# EAGLE design FAL65816_Backplane (EAGLE 7.2.0)
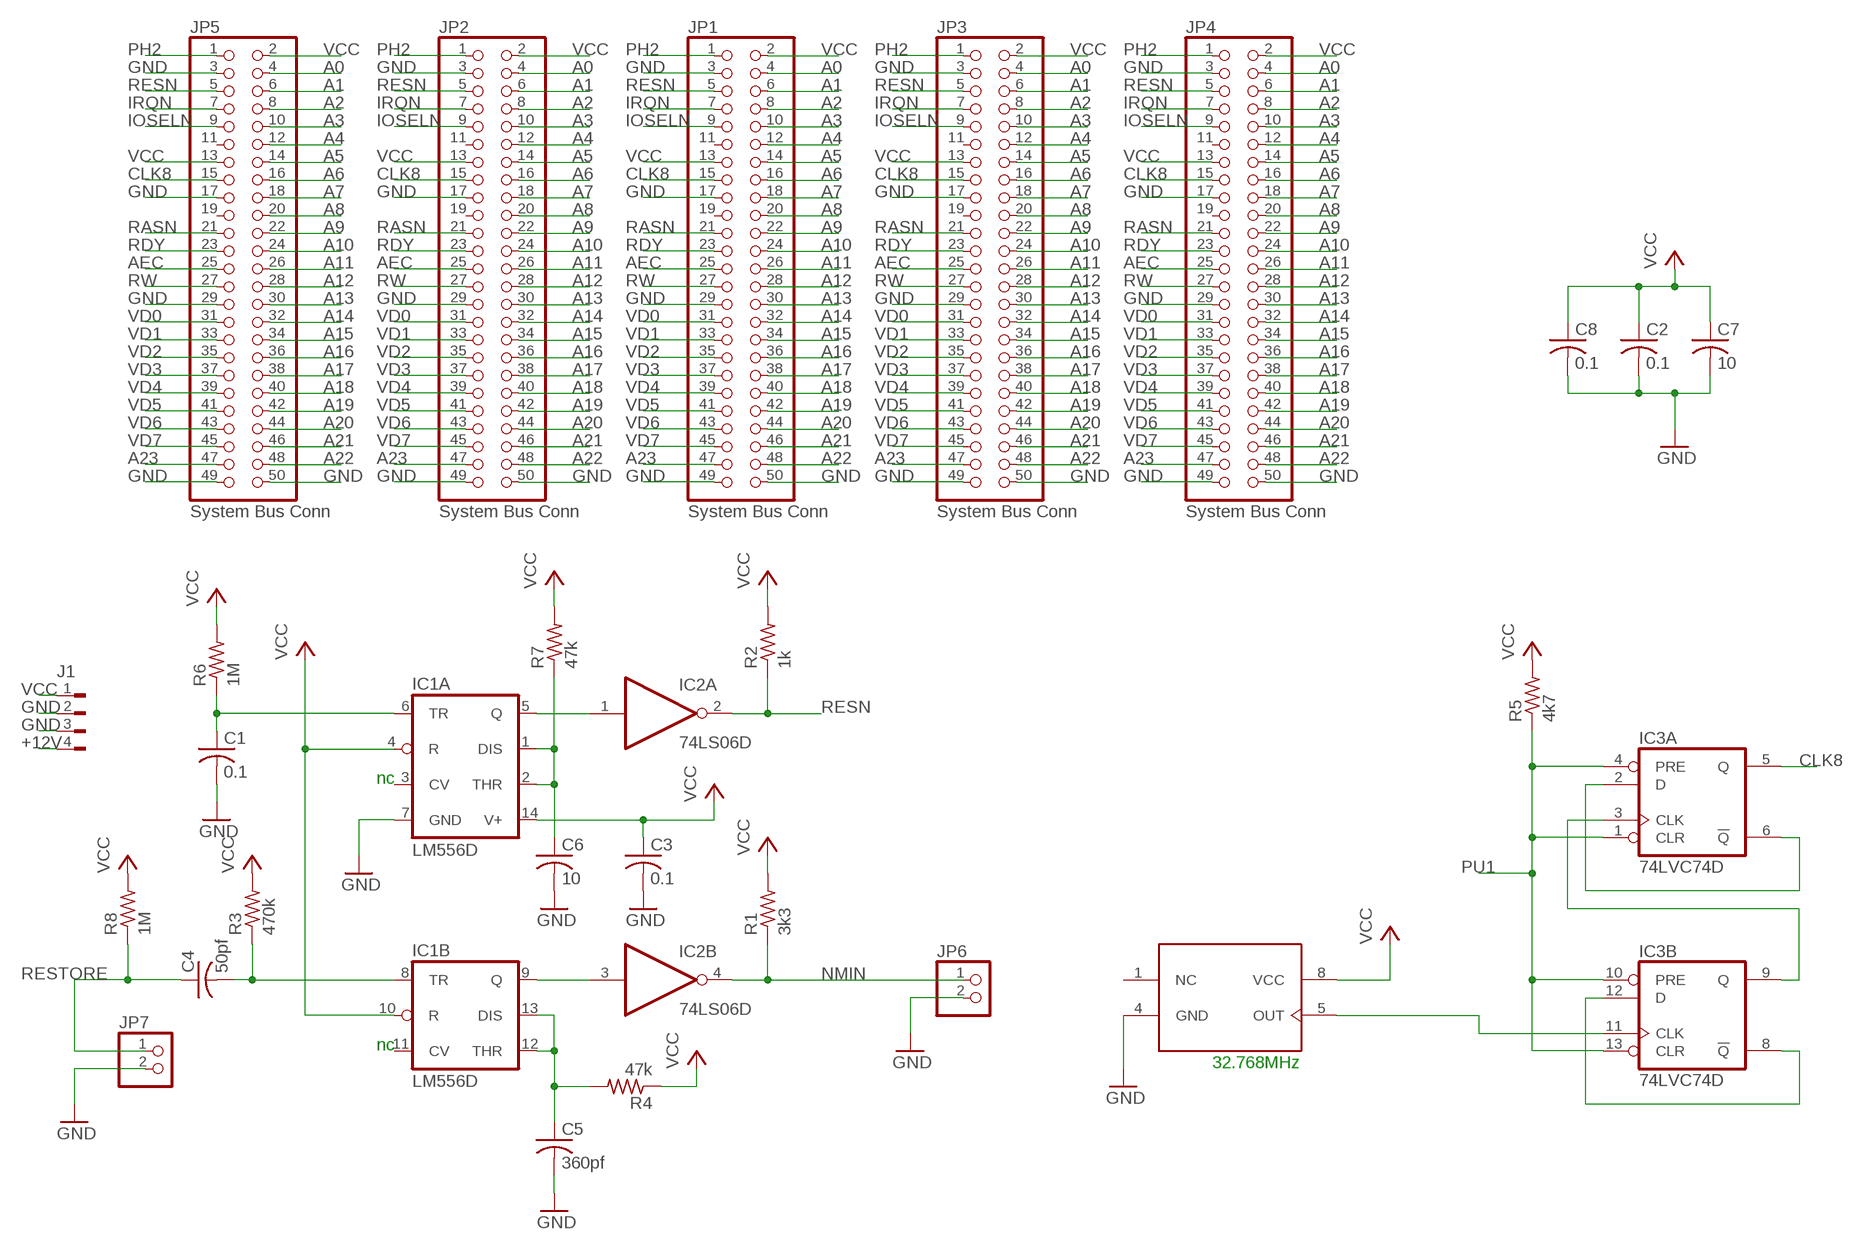
[diagram p0: schematic, sheet 1]

## Parts
C1  0.1  C-US050-024X044  [C050-024X044]
C2  0.1  C-US050-024X044  [C050-024X044]
C3  0.1  C-US050-024X044  [C050-024X044]
C4  50pf  C-US050-024X044  [C050-024X044]
C5  360pf  C-US050-024X044  [C050-024X044]
C6  10  C-US050-024X044  [C050-024X044]
C7  10  C-US050-024X044  [C050-024X044]
C8  0.1  C-US050-024X044  [C050-024X044]
IC1  LM556D  [SO14]
IC2  74LS06D  [SO14]
IC3  74LVC74D  74LS74D  [SO14]
J1  FLOPPY-4  [FLOPPY-4]
JP1  System Bus Conn  PINHD-2X25  [2X25]
JP2  System Bus Conn  PINHD-2X25  [2X25]
JP3  System Bus Conn  PINHD-2X25  [2X25]
JP4  System Bus Conn  PINHD-2X25  [2X25]
JP5  System Bus Conn  PINHD-2X25  [2X25]
JP6  PINHD-1X2  [1X02]
JP7  PINHD-1X2  [1X02]
R1  3k3  R-US_0204/7  [0204/7]
R2  1k  R-US_0204/7  [0204/7]
R3  470k  R-US_0204/7  [0204/7]
R4  47k  R-US_0204/7  [0204/7]
R5  4k7  R-US_0204/7  [0204/7]
R6  1M  R-US_0204/7  [0204/7]
R7  47k  R-US_0204/7  [0204/7]
R8  1M  R-US_0204/7  [0204/7]
U$1  OSC  [DIL08]

## Nets
+12V: J1.4
A0: JP1.4 JP2.4 JP3.4 JP4.4 JP5.4
A1: JP1.6 JP2.6 JP3.6 JP4.6 JP5.6
A2: JP1.8 JP2.8 JP3.8 JP4.8 JP5.8
A3: JP1.10 JP2.10 JP3.10 JP4.10 JP5.10
A4: JP1.12 JP2.12 JP3.12 JP4.12 JP5.12
A5: JP1.14 JP2.14 JP3.14 JP4.14 JP5.14
A6: JP1.16 JP2.16 JP3.16 JP4.16 JP5.16
A7: JP1.18 JP2.18 JP3.18 JP4.18 JP5.18
A8: JP1.20 JP2.20 JP3.20 JP4.20 JP5.20
A9: JP1.22 JP2.22 JP3.22 JP4.22 JP5.22
A10: JP1.24 JP2.24 JP3.24 JP4.24 JP5.24
A11: JP1.26 JP2.26 JP3.26 JP4.26 JP5.26
A12: JP1.28 JP2.28 JP3.28 JP4.28 JP5.28
A13: JP1.30 JP2.30 JP3.30 JP4.30 JP5.30
A14: JP1.32 JP2.32 JP3.32 JP4.32 JP5.32
A15: JP1.34 JP2.34 JP3.34 JP4.34 JP5.34
A16: JP1.36 JP2.36 JP3.36 JP4.36 JP5.36
A17: JP1.38 JP2.38 JP3.38 JP4.38 JP5.38
A18: JP1.40 JP2.40 JP3.40 JP4.40 JP5.40
A19: JP1.42 JP2.42 JP3.42 JP4.42 JP5.42
A20: JP1.44 JP2.44 JP3.44 JP4.44 JP5.44
A21: JP1.46 JP2.46 JP3.46 JP4.46 JP5.46
A22: JP1.48 JP2.48 JP3.48 JP4.48 JP5.48
A23: JP1.47 JP2.47 JP3.47 JP4.47 JP5.47
AEC: JP1.25 JP2.25 JP3.25 JP4.25 JP5.25
CLK8: IC3.5(A:Q) JP1.15 JP2.15 JP3.15 JP4.15 JP5.15
GND: C1.2 C2.2 C3.2 C5.2 C6.2 C7.2 C8.2 IC1.7(A:GND) J1.2 J1.3 JP1.3 JP1.17 JP1.29 JP1.49 JP1.50 JP2.3 JP2.17 JP2.29 JP2.49 JP2.50 JP3.3 JP3.17 JP3.29 JP3.49 JP3.50 JP4.3 JP4.17 JP4.29 JP4.49 JP4.50 JP5.3 JP5.17 JP5.29 JP5.49 JP5.50 JP6.2 JP7.2 U$1.4(GND)
IOSELN: JP1.9 JP2.9 JP3.9 JP4.9 JP5.9
IRQN: JP1.7 JP2.7 JP3.7 JP4.7 JP5.7
N$2: IC3.3(A:CLK) IC3.9(B:Q)
N$3: IC1.5(A:Q) IC2.1(A:I)
N$4: IC3.8(B:!Q) IC3.12(B:D)
N$5: IC1.9(B:Q) IC2.3(B:I)
N$6: C1.1 IC1.6(A:TR) R6.1
N$7: IC3.11(B:CLK) U$1.5(OUT)
N$8: IC3.2(A:D) IC3.6(A:!Q)
N$10: C6.1 IC1.1(A:DIS) IC1.2(A:THR) R7.1
N$12: C4.2 IC1.8(B:TR) R3.1
N$14: C5.1 IC1.12(B:THR) IC1.13(B:DIS) R4.2
NMIN: IC2.4(B:O) JP6.1 R1.1
PH2: JP1.1 JP2.1 JP3.1 JP4.1 JP5.1
PU1: IC3.1(A:CLR) IC3.4(A:PRE) IC3.10(B:PRE) IC3.13(B:CLR) R5.1
RASN: JP1.21 JP2.21 JP3.21 JP4.21 JP5.21
RDY: JP1.23 JP2.23 JP3.23 JP4.23 JP5.23
RESN: IC2.2(A:O) JP1.5 JP2.5 JP3.5 JP4.5 JP5.5 R2.1
RESTORE: C4.1 JP7.1 R8.1
RW: JP1.27 JP2.27 JP3.27 JP4.27 JP5.27
VCC: C2.1 C3.1 C7.1 C8.1 IC1.4(A:R) IC1.10(B:R) IC1.14(A:V+) J1.1 JP1.2 JP1.13 JP2.2 JP2.13 JP3.2 JP3.13 JP4.2 JP4.13 JP5.2 JP5.13 R1.2 R2.2 R3.2 R4.1 R5.2 R6.2 R7.2 R8.2 U$1.8(VCC)
VD0: JP1.31 JP2.31 JP3.31 JP4.31 JP5.31
VD1: JP1.33 JP2.33 JP3.33 JP4.33 JP5.33
VD2: JP1.35 JP2.35 JP3.35 JP4.35 JP5.35
VD3: JP1.37 JP2.37 JP3.37 JP4.37 JP5.37
VD4: JP1.39 JP2.39 JP3.39 JP4.39 JP5.39
VD5: JP1.41 JP2.41 JP3.41 JP4.41 JP5.41
VD6: JP1.43 JP2.43 JP3.43 JP4.43 JP5.43
VD7: JP1.45 JP2.45 JP3.45 JP4.45 JP5.45
Unconnected: IC1.3(A:CV) IC1.11(B:CV) IC2.5(C:I) IC2.6(C:O) IC2.8(D:O) IC2.9(D:I) IC2.10(E:O) IC2.11(E:I) IC2.12(F:O) IC2.13(F:I) JP1.11 JP1.19 JP2.11 JP2.19 JP3.11 JP3.19 JP4.11 JP4.19 JP5.11 JP5.19 U$1.1(NC)

## Notes on the sheet
- nc
- nc
- 32.768MHz

## Power pins joined to a net without a drawn wire
GND: IC2.7(P:GND) IC3.7(P:GND)
VCC: IC2.14(P:VCC) IC3.14(P:VCC)

## Library data of the parts
C1-C8 = rcl:C-US: CAPACITOR, American symbol
IC1 = linear:*556: Dual TIMER
IC2 = FT74xx:74*06: Hex INVERTER, open collector high-voltage output
IC3 = FT74xx:74*74: Dual D type positive edge triggered FLIP FLOP, preset and clear
J1 = con-amp:FLOPPY-4: MATE N-LOCK Floppy / HDD conector Distributor: Bürklin 71F970
JP1-JP5 = pinhead:PINHD-2X25: PIN HEADER
JP6 JP7 = pinhead:PINHD-1X2: PIN HEADER
R1-R8 = resistor:R-US_: RESISTOR, American symbol
U$1 = FT74xx:OSC

## Board
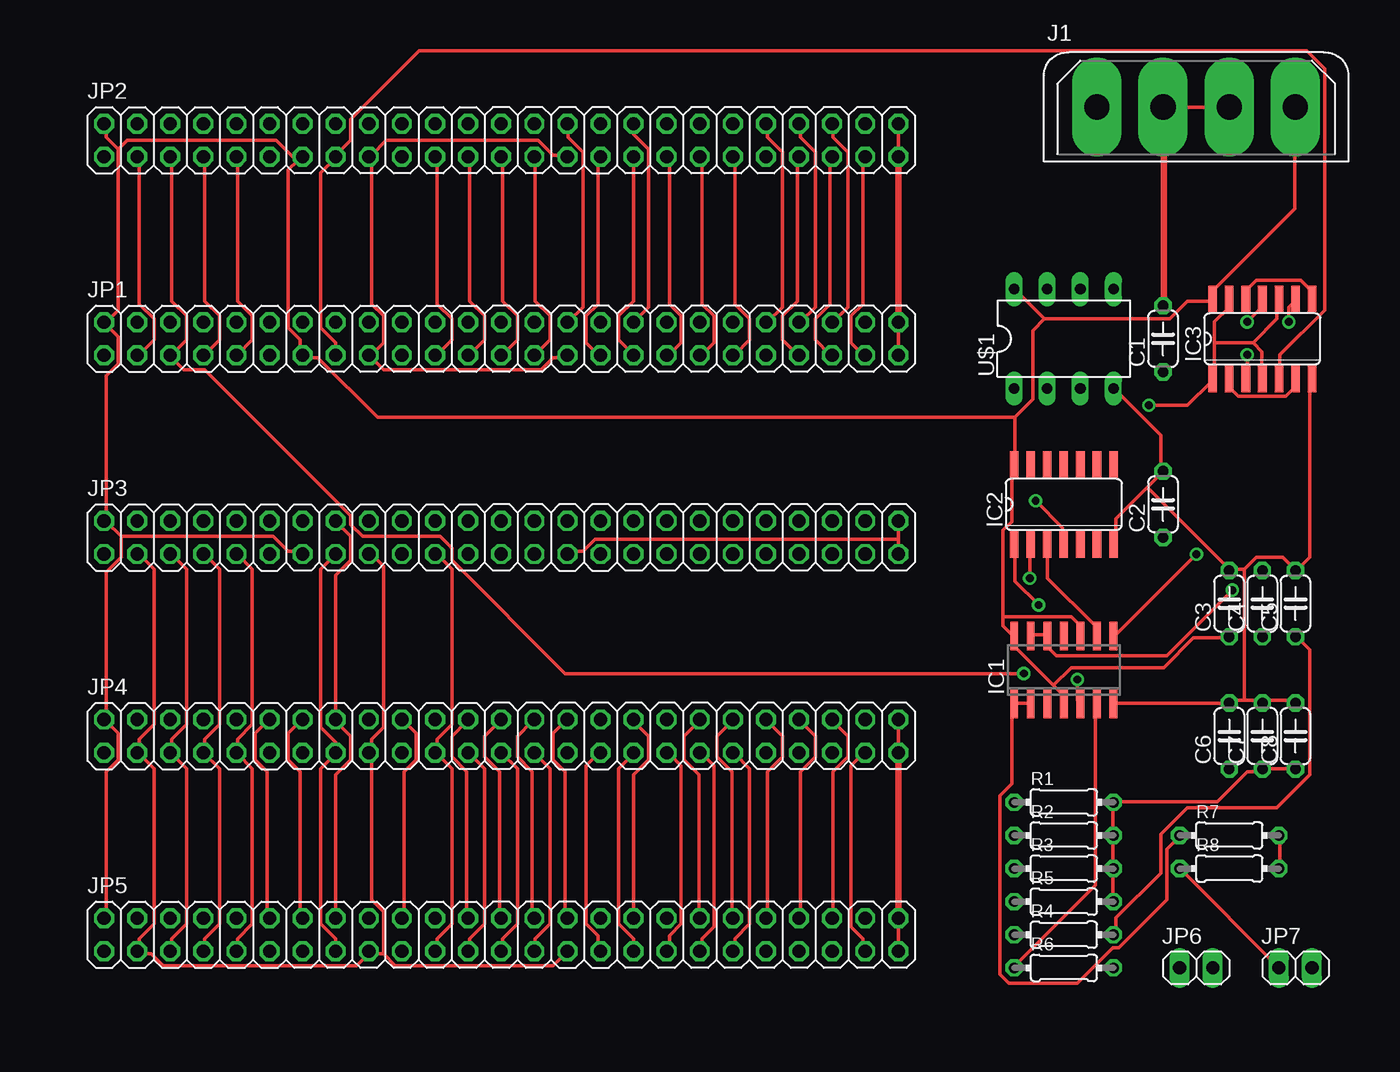
[diagram p1: board, top side]
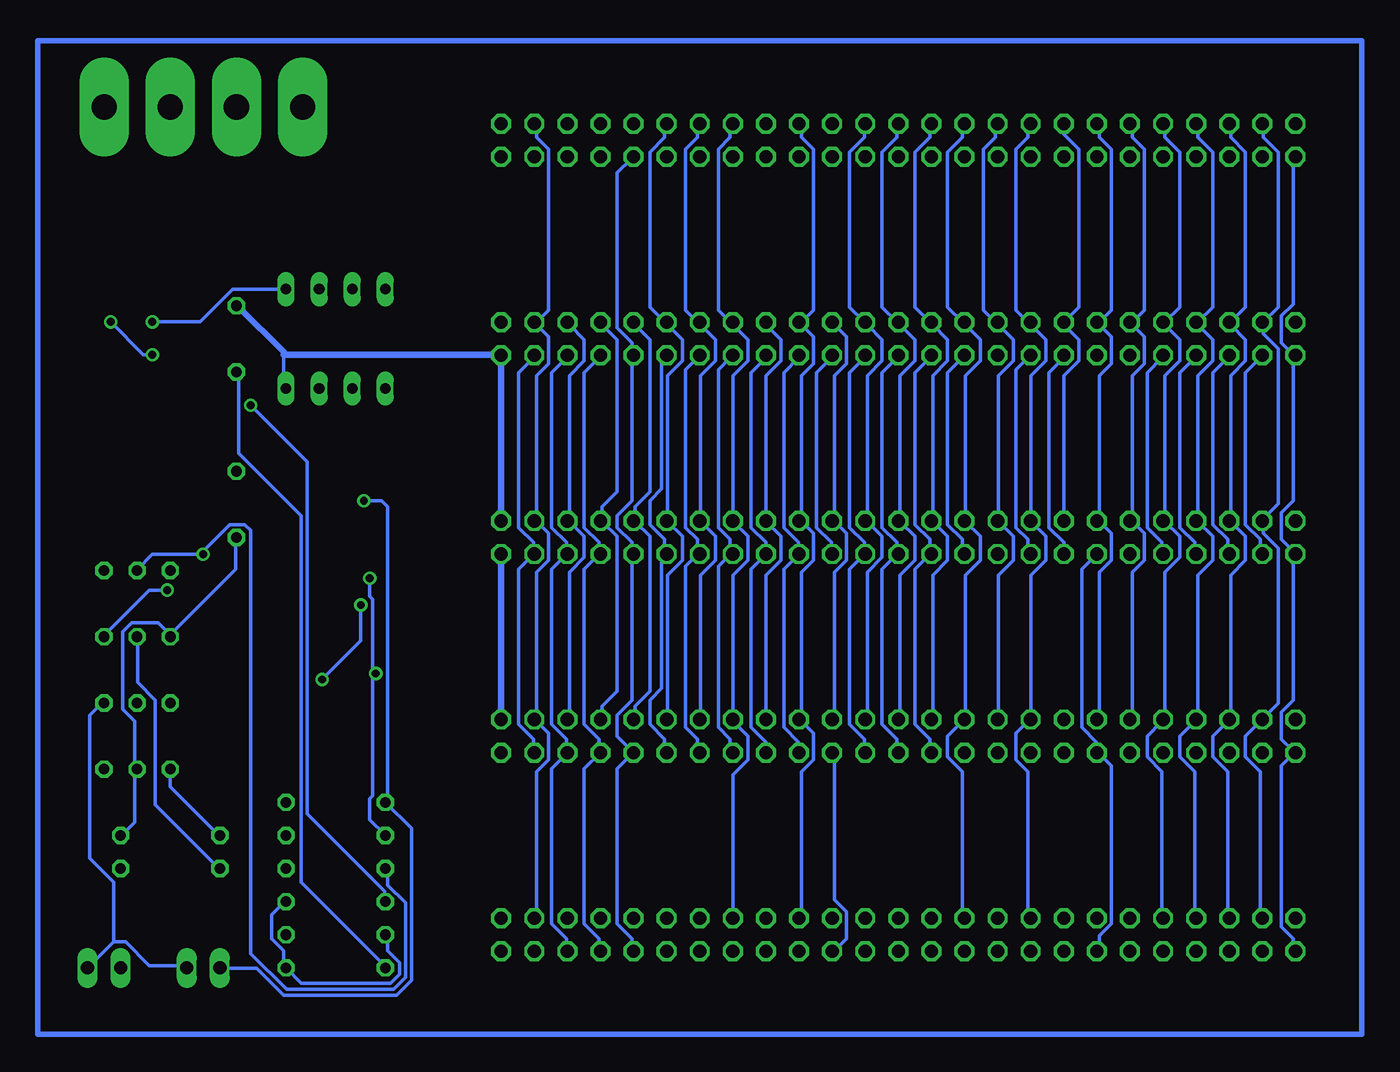
[diagram p2: board, bottom side, seen from below]

No outline drawn. Coordinates in mm, seen from the top.
Copper layers (1*16): Top 0.035mm / dielectric 1.5mm / Bottom 0.035mm
Design rules "default": minimum track width 10mil, minimum drill 24mil, track to track 8mil, track to pad 8mil, pad to pad 8mil, via to via 8mil, smd to smd 8mil, copper to edge 40mil, drill to drill 8mil, minimum pad ring 10mil, minimum via ring 8mil, stop-mask expansion 4mil, vias tented up to drill 0mil, thermal gap 10mil

### Footprints (pad centres in the part's own frame; a part is rotated, then mirrored left to right if it is on the bottom)
C050-024X044 = drill 0.813 octagon: 1 -2.54,0; 2 2.54,0
SO14 = smd 0.6 x 2.2: 1 -3.81,-2.6; 2 -2.54,-2.6; 3 -1.27,-2.6; 4 0,-2.6; 5 1.27,-2.6; 6 2.54,-2.6; 7 3.81,-2.6; 8 3.81,2.6; 9 2.54,2.6; 10 1.27,2.6; 11 0,2.6; 12 -1.27,2.6; 13 -2.54,2.6; 14 -3.81,2.6
SO14' = smd 0.66 x 2.032: 1 -3.81,-3.073; 2 -2.54,-3.073; 3 -1.27,-3.073; 4 0,-3.073; 5 1.27,-3.073; 6 2.54,-3.073; 7 3.81,-3.073; 8 3.81,3.073; 9 2.54,3.073; 10 1.27,3.073; 11 0,3.073; 12 -1.27,3.073; 13 -2.54,3.073; 14 -3.81,3.073
FLOPPY-4 = drill 1.93 pad 3.81 long: 1 7.62,0; 2 2.54,0; 3 -2.54,0; 4 -7.62,0
2X25 = drill 1.016 octagon: 1 -30.48,-1.27; 2 -30.48,1.27; 3 -27.94,-1.27; 4 -27.94,1.27; 5 -25.4,-1.27; 6 -25.4,1.27; 7 -22.86,-1.27; 8 -22.86,1.27; 9 -20.32,-1.27; 10 -20.32,1.27; 11 -17.78,-1.27; 12 -17.78,1.27; 13 -15.24,-1.27; 14 -15.24,1.27; 15 -12.7,-1.27; 16 -12.7,1.27; 17 -10.16,-1.27; 18 -10.16,1.27; 19 -7.62,-1.27; 20 -7.62,1.27; 21 -5.08,-1.27; 22 -5.08,1.27; 23 -2.54,-1.27; 24 -2.54,1.27; 25 0,-1.27; 26 0,1.27; 27 2.54,-1.27; 28 2.54,1.27; 29 5.08,-1.27; 30 5.08,1.27; 31 7.62,-1.27; 32 7.62,1.27; 33 10.16,-1.27; 34 10.16,1.27; 35 12.7,-1.27; 36 12.7,1.27; 37 15.24,-1.27; 38 15.24,1.27; 39 17.78,-1.27; 40 17.78,1.27; 41 20.32,-1.27; 42 20.32,1.27; 43 22.86,-1.27; 44 22.86,1.27; 45 25.4,-1.27; 46 25.4,1.27; 47 27.94,-1.27; 48 27.94,1.27; 49 30.48,-1.27; 50 30.48,1.27
1X02 = drill 1.016 long: 1 -1.27,0; 2 1.27,0
0204/7 = drill 0.813 octagon: 1 -3.81,0; 2 3.81,0
DIL08 = drill 0.813 long: 1 -3.81,-3.81; 2 -1.27,-3.81; 3 1.27,-3.81; 4 3.81,-3.81; 5 3.81,3.81; 6 1.27,3.81; 7 -1.27,3.81; 8 -3.81,3.81

### Placement (x,y rotation side)
C1  86.36,53.34 90 top
C2  86.36,40.64 90 top
C3  91.44,33.02 90 top
C4  93.98,33.02 90 top
C5  96.52,33.02 90 top
C6  91.44,22.86 90 top
C7  93.98,22.86 90 top
C8  96.52,22.86 90 top
IC1  78.74,27.94 0 top
IC2  74LS06D  [SO14']  78.74,40.64 0 top
IC3  74LVC74D  [SO14']  93.98,53.34 0 top
J1  88.9,71.12 0 top
JP1  35.56,53.34 0 top
JP2  35.56,68.58 0 top
JP3  35.56,38.1 0 top
JP4  35.56,22.86 0 top
JP5  35.56,7.62 0 top
JP6  88.9,5.08 0 top
JP7  96.52,5.08 0 top
R1  78.74,17.78 0 top
R2  78.74,15.24 0 top
R3  78.74,12.7 0 top
R4  78.74,7.62 0 top
R5  78.74,10.16 0 top
R6  78.74,5.08 0 top
R7  91.44,15.24 0 top
R8  91.44,12.7 0 top
U$1  78.74,53.34 0 top

### Tracks (layer width: path | path; a pad name or v marks a point on that pad's centre or on a via)
A0
  Bottom 0.254: JP5.4 7.77,8.91 7.77,20.12 8.91,21.26 8.91,22.86 7.77,24 JP4.4 7.54,24.23 6.4,25.38 6.4,37.26 7.54,38.41 7.54,39.32 JP3.4 7.54,39.55 6.4,40.69 6.4,52.58 7.54,53.72 7.54,54.41 JP1.4 7.54,54.63 6.4,55.78 6.4,67.67 7.54,68.81 7.54,69.72 JP2.4
A1
  Bottom 0.254: JP5.6 10.29,8.91 10.29,20.12 11.43,21.26 11.43,22.86 JP4.6 10.06,24.23 10.06,35.2 8.91,36.35 8.91,38.18 10.06,39.32 JP3.6 10.06,39.55 10.06,50.52 8.91,51.66 8.91,53.26 10.06,54.41 JP1.6 10.06,54.63 8.91,55.78 8.91,67.67 10.06,68.81 10.06,69.72 JP2.6
A2
  Bottom 0.254: JP5.8 12.8,8.91 12.8,20.12 13.95,21.26 13.95,22.86 12.8,24 JP4.8 12.57,24.23 12.57,35.2 11.43,36.35 11.43,38.18 12.57,39.32 JP3.8 12.57,39.55 12.57,50.52 11.43,51.66 11.43,53.26 12.57,54.41 JP1.8 12.57,54.63 11.43,55.78 11.43,67.67 12.57,68.81 12.57,69.72 JP2.8
A3
  Bottom 0.254: JP5.10 15.32,8.91 15.32,20.12 16.46,21.26 16.46,22.86 15.32,24 JP4.10 15.09,24.23 15.09,35.43 13.95,36.58 13.95,38.18 15.09,39.32 JP3.10 15.09,39.55 15.09,50.52 13.95,51.66 13.95,53.26 15.09,54.41 JP1.10 15.09,54.63 13.95,55.78 13.95,67.67 15.09,68.81 15.09,69.72 JP2.10
A4
  Top 0.254: JP5.12 17.6,8.91 17.6,20.12 16.69,21.03 16.69,23.09 17.6,24 JP4.12
  Bottom 0.254: JP2.12 17.6,69.72 17.6,68.81 16.69,67.89 16.69,55.55 17.6,54.63 JP1.12 17.6,54.41 16.69,53.49 16.69,51.44 17.6,50.52 17.6,39.55 JP3.12 17.6,39.32 16.69,38.41 16.69,36.35 17.6,35.43 17.6,24.23 JP4.12
A5
  Top 0.254: JP5.14 20.12,8.91 20.12,20.12 19.2,21.03 19.2,23.09 20.12,24 JP4.14
  Bottom 0.254: JP2.14 20.12,69.72 20.12,68.81 19.2,67.89 19.2,55.55 20.12,54.63 JP1.14 19.2,53.49 19.2,51.44 20.12,50.52 20.12,39.55 JP3.14 20.12,39.32 19.2,38.41 19.2,36.35 20.12,35.43 20.12,24.23 JP4.14
A6
  Top 0.254: JP5.16 22.86,19.89 24,21.03 24,22.86 22.86,24 JP4.16 22.86,35.2 24,36.35 24,38.18 22.86,39.32 JP3.16
  Bottom 0.254: JP3.16 22.86,50.52 21.72,51.66 21.72,53.26 22.86,54.41 JP1.16 22.86,54.63 21.72,55.78 21.72,67.89 22.86,69.04 JP2.16
A7
  Bottom 0.254: JP5.18 25.6,8.91 25.6,20.12 26.52,21.03 26.52,23.09 25.6,24 JP4.18 25.38,24.23 25.38,35.2 24.23,36.35 24.23,38.18 25.38,39.32 JP3.18 25.38,39.55 25.38,50.52 24.23,51.66 24.23,53.26 25.38,54.41 JP1.18 25.6,54.63 26.52,55.55 26.52,67.89 25.6,68.81 25.6,69.72 JP2.18
A8
  Top 0.254: JP5.20 28.12,8.91 28.12,20.12 29.03,21.03 29.03,23.09 28.12,24 JP4.20
  Bottom 0.254: JP2.20 28.12,69.72 28.12,68.81 29.03,67.89 29.03,55.55 28.12,54.63 JP1.20 27.89,54.41 26.75,53.26 26.75,51.66 27.89,50.52 27.89,39.55 JP3.20 26.75,38.18 26.75,36.35 27.89,35.2 27.89,24.23 JP4.20
A9
  Bottom 0.254: JP5.22 30.63,8.91 30.63,20.12 31.77,21.26 31.77,22.86 30.63,24 JP4.22 30.4,24.23 30.4,35.2 29.26,36.35 29.26,38.18 30.4,39.32 JP3.22 30.4,39.55 30.4,50.52 29.26,51.66 29.26,53.26 30.4,54.41 JP1.22 30.63,54.63 31.77,55.78 31.77,67.67 30.63,68.81 30.63,69.72 JP2.22
A10
  Top 0.254: JP5.24 32.92,8.91 32.92,20.12 31.77,21.26 31.77,22.86 32.92,24 JP4.24
  Bottom 0.254: JP2.24 33.15,69.72 33.15,68.81 34.29,67.67 34.29,55.78 33.15,54.63 JP1.24 32.92,54.41 31.77,53.26 31.77,51.66 32.92,50.52 32.92,39.55 JP3.24 32.92,39.32 31.77,38.18 31.77,36.35 32.92,35.2 32.92,24.23 JP4.24
A11
  Top 0.254: JP4.26 34.29,22.86 34.29,21.26 35.43,20.12 35.43,8.91 JP5.26
  Bottom 0.254: JP2.26 35.66,69.72 35.66,68.81 36.8,67.67 36.8,55.78 35.66,54.63 JP1.26 35.43,54.41 34.29,53.26 34.29,51.66 35.43,50.52 35.43,39.55 JP3.26 35.43,39.32 34.29,38.18 34.29,36.35 35.43,35.2 35.43,24.23 JP4.26
A12
  Top 0.254: JP5.28 37.95,8.91 37.95,20.12 36.8,21.26 36.8,22.86 37.95,24 JP4.28
  Bottom 0.254: JP2.28 38.18,69.72 38.18,68.81 39.32,67.67 39.32,55.78 38.18,54.63 JP1.28 37.95,54.41 36.8,53.26 36.8,51.66 37.95,50.52 37.95,39.55 JP3.28 37.95,39.32 36.8,38.18 36.8,36.58 37.95,35.43 37.95,24.23 JP4.28
A13
  Top 0.254: JP5.30 40.46,8.91 40.46,20.12 39.55,21.03 39.55,23.09 40.46,24 JP4.30 | JP2.30 40.69,69.72 40.69,68.81 41.83,67.67 41.83,55.78 40.69,54.63 JP1.30
  Bottom 0.254: JP1.30 40.46,54.41 39.55,53.49 39.55,51.44 40.46,50.52 40.46,39.55 JP3.30 40.46,39.32 39.55,38.41 39.55,36.35 40.46,35.43 40.46,24.23 JP4.30
A14
  Bottom 0.254: JP5.32 42.98,8.91 42.98,20.12 42.06,21.03 42.06,23.09 42.98,24 JP4.32 42.98,24.23 42.98,35.43 42.06,36.35 42.06,38.41 42.98,39.32 JP3.32 42.98,39.55 42.98,50.52 42.06,51.44 42.06,53.49 JP1.32 42.98,54.63 42.06,55.55 42.06,67.89 42.98,68.81 42.98,69.72 JP2.32
A15
  Top 0.254: JP5.34 45.72,19.89 46.86,21.03 46.86,22.86 45.72,24 JP4.34 | JP2.34 45.72,69.04 46.86,67.89 46.86,55.78 45.72,54.63 JP1.34
  Bottom 0.254: JP1.34 45.72,54.41 44.58,53.26 44.58,51.66 45.72,50.52 JP3.34 45.72,39.32 44.58,38.18 44.58,36.35 45.72,35.2 JP4.34
A16
  Bottom 0.254: JP5.36 48.23,8.91 48.23,19.89 47.09,21.03 47.09,22.86 48.23,24 JP4.36 48.23,24.23 48.23,35.2 47.09,36.35 47.09,38.18 48.23,39.32 JP3.36 48.23,39.55 48.23,50.52 47.09,51.66 47.09,53.26 48.23,54.41 JP1.36 48.46,54.63 49.38,55.55 49.38,67.89 48.46,68.81 48.46,69.72 JP2.36
A17
  Top 0.254: JP5.38 50.75,8.91 50.75,19.89 49.61,21.03 49.61,22.86 50.75,24 JP4.38
  Bottom 0.254: JP2.38 50.98,69.72 50.98,68.81 51.89,67.89 51.89,55.55 50.98,54.63 JP1.38 50.75,54.41 49.61,53.26 49.61,51.66 50.75,50.52 50.75,39.55 JP3.38 49.61,38.18 49.61,36.35 50.75,35.2 50.75,24.23 JP4.38
A18
  Top 0.254: JP5.40 53.26,8.91 53.26,20.12 52.12,21.26 52.12,22.86 53.26,24 JP4.40
  Bottom 0.254: JP2.40 53.49,69.72 53.49,68.81 54.63,67.67 54.63,55.78 53.49,54.63 JP1.40 53.26,54.41 52.12,53.26 52.12,51.66 53.26,50.52 53.26,39.55 JP3.40 53.26,39.32 52.12,38.18 52.12,36.35 53.26,35.2 53.26,24.23 JP4.40
A19
  Top 0.254: JP4.42 57.15,22.86 57.15,21.26 56.01,20.12 56.01,8.91 JP5.42 | JP2.42 56.01,69.72 56.01,68.81 57.15,67.67 57.15,55.78 56.01,54.63 JP1.42
  Bottom 0.254: JP1.42 55.78,54.41 54.63,53.26 54.63,41.6 55.78,40.46 55.78,39.55 JP3.42 55.78,39.32 54.63,38.18 54.63,26.29 55.78,25.15 55.78,24.23 JP4.42
A20
  Top 0.254: JP5.44 58.52,8.91 58.52,20.12 59.66,21.26 59.66,22.86 58.52,24 JP4.44 | JP2.44 58.52,69.72 58.52,68.81 59.66,67.67 59.66,55.78 58.52,54.63 JP1.44
  Bottom 0.254: JP1.44 58.29,54.41 57.15,53.26 57.15,41.6 58.29,40.46 58.29,39.55 JP3.44 58.29,39.32 57.15,38.18 57.15,26.29 58.29,25.15 58.29,24.23 JP4.44
A21
  Top 0.254: JP5.46 61.04,8.91 61.04,20.12 62.18,21.26 62.18,22.86 61.04,24 JP4.46 | JP2.46 61.04,69.72 61.04,68.81 62.18,67.67 62.18,55.78 61.04,54.63 JP1.46
  Bottom 0.254: JP1.46 60.81,54.41 59.66,53.26 59.66,51.66 60.81,50.52 60.81,39.55 JP3.46 60.81,39.32 59.66,38.18 59.66,36.58 60.81,35.43 60.81,24.23 JP4.46
A22
  Bottom 0.254: JP5.48 63.32,8.91 63.32,20.12 62.41,21.03 62.41,23.09 63.32,24 JP4.48 63.32,24.23 63.32,35.43 62.41,36.35 62.41,38.41 63.32,39.32 JP3.48 63.32,39.55 63.32,50.52 62.41,51.44 62.41,53.49 63.32,54.41 JP1.48 63.32,54.63 62.41,55.55 62.41,67.89 63.32,68.81 63.32,69.72 JP2.48
A23
  Top 0.254: JP5.47 63.32,6.4 63.32,7.32 62.41,8.23 62.41,20.57 63.32,21.49 JP4.47 | JP2.47 63.32,67.21 63.32,56.01 62.41,55.09 62.41,53.03 63.32,52.12 JP1.47
  Bottom 0.254: JP1.47 63.55,51.89 64.69,50.75 64.69,38.86 63.55,37.72 63.55,37.03 JP3.47 63.55,36.8 64.69,35.66 64.69,23.77 63.55,22.63 63.55,21.72 JP4.47
AEC
  Top 0.254: JP4.25 36.8,20.34 36.8,8.46 35.66,7.32 35.66,6.4 JP5.25 | JP2.25 35.66,67.21 35.66,56.24 36.8,55.09 36.8,53.26 35.66,52.12 JP1.25
  Bottom 0.254: JP1.25 35.66,51.89 36.8,50.75 36.8,38.86 35.66,37.72 35.66,37.03 JP3.25 35.66,36.8 36.8,35.66 36.8,23.77 35.66,22.63 35.66,21.72 JP4.25
CLK8
  Top 0.254: JP5.15 22.86,7.32 21.72,8.46 21.72,20.34 22.86,21.49 JP4.15 22.86,22.4 21.72,23.55 21.72,35.66 22.86,36.8 JP3.15 | IC3.5 95.33,50.29 95.33,52.12 98.75,55.55 98.75,74.07 97.38,75.44 29.26,75.44 24,70.18 24,68.58 22.86,67.44 JP2.15 22.86,67.21 21.72,66.06 21.72,54.18 22.86,53.03 JP1.15
  Bottom 0.254: JP3.15 22.86,37.72 24,38.86 24,50.75 22.86,51.89 JP1.15
GND
  Top 0.254: JP2.3 7.77,67.21 7.77,56.01 8.91,54.86 8.91,53.26 7.77,52.12 JP1.3 | JP3.3 7.77,36.8 8.91,35.66 8.91,23.77 7.77,22.63 7.77,21.72 JP4.3 7.77,21.49 8.91,20.34 8.91,8.46 7.77,7.32 7.77,6.4 JP5.3 7.77,6.17 8.69,6.17 9.6,5.26 24.46,5.26 25.38,6.17 JP5.17 25.6,6.17 26.52,6.17 | 26.52,6.17 27.43,5.26 39.55,5.26 JP5.29 | 26.52,6.17 26.52,9.37 25.6,10.29 25.6,21.49 JP4.17 25.6,21.72 25.6,22.63 26.52,23.55 26.52,35.89 25.6,36.8 JP3.17 | JP2.29 40.46,67.44 39.55,67.44 38.41,68.58 26.75,68.58 25.6,67.44 JP2.17 25.6,67.21 25.6,56.01 26.52,55.09 26.52,53.03 25.6,52.12 JP1.17 25.6,51.89 26.52,50.98 38.63,50.98 39.55,51.89 40.46,51.89 JP1.29 | JP5.49 66.06,6.4 66.06,8.69 JP5.50 66.06,8.91 | JP4.50 66.06,24 66.06,21.72 JP4.49 66.06,21.49 | JP2.50 66.06,69.72 66.06,67.44 JP2.49 66.06,67.21 | 66.06,37.95 66.06,39.32 JP3.50 | 66.06,37.95 66.06,37.03 JP3.49 | JP1.49 66.06,52.12 66.06,54.41 JP1.50 66.06,54.63 | C8.2 96.47,25.6 94.18,25.6 C7.2 93.95,25.6 92.58,25.6 | IC1.7 82.75,25.38 91.44,25.38 C6.2 91.44,25.6 92.58,25.6 | IC3.7 97.61,50.06 97.61,36.58 96.7,35.66 C5.2 96.47,35.66 95.56,36.58 93.5,36.58 92.58,35.66 | 92.58,35.66 91.44,35.66 | J1.2 91.44,71.09 86.41,71.09 J1.3 | 85.04,41.83 86.18,42.98 C2.2 86.18,43.2 86.18,45.95 82.75,49.38 U$1.4 | 85.04,41.83 82.75,39.55 82.75,37.72 IC2.7 | 86.41,56.01 C1.2 | 91.44,35.66 85.27,41.83 85.04,41.83 | 91.44,35.66 C3.2 | 92.58,35.66 92.58,25.6 | 66.06,37.95 42.75,37.95 41.83,37.03 40.69,37.03 JP3.29
  Top 0.508: 66.06,21.49 66.06,8.91 | 66.06,54.63 66.06,67.21 | 86.41,56.01 86.41,71.09
  Bottom 0.254: JP3.3 7.77,37.03 7.77,37.95 8.91,39.09 8.91,50.75 7.77,51.89 JP1.3 | JP4.29 40.46,21.49 40.46,10.29 39.55,9.37 39.55,7.32 40.46,6.4 JP5.29 | JP3.29 40.69,37.03 40.69,37.72 41.83,38.86 41.83,50.75 40.69,51.89 JP1.29 | JP3.17 25.6,37.03 25.6,37.95 26.52,38.86 26.52,50.98 25.6,51.89 JP1.17 | 66.06,39.55 JP3.50 | 66.06,51.89 JP1.49 66.06,52.12 | 66.06,24.23 JP4.50 | 66.06,36.8 JP3.49 | 95.78,7.09 94.87,7.09 93.04,5.26 90.3,5.26 JP6.2 | JP7.2 95.78,7.09 | 95.78,7.09 95.78,11.66 97.61,13.49 97.61,24.46 96.7,25.38 C8.2 | 82.75,52.35 82.75,52.12 82.75,49.61 U$1.4 | 86.18,55.78 C1.2
  Bottom 0.508: 66.06,51.89 66.06,39.55 | 66.06,36.8 66.06,24.23 | 86.18,55.78 82.75,52.35 | 82.75,52.12 66.06,52.12
IOSELN
  Top 0.254: JP5.9 15.32,6.4 15.32,7.32 16.46,8.46 16.46,20.34 15.32,21.49 JP4.9 15.32,21.72 15.32,22.63 16.46,23.77 16.46,35.66 15.32,36.8 JP3.9 | JP2.9 15.32,67.21 15.32,56.24 16.46,55.09 16.46,53.26 15.32,52.12 JP1.9
  Bottom 0.254: JP3.9 15.32,37.03 15.32,37.72 16.46,38.86 16.46,50.75 15.32,51.89 JP1.9
IRQN
  Top 0.254: JP5.7 12.8,6.4 12.8,7.32 13.95,8.46 13.95,20.34 JP4.7 12.8,21.72 12.8,22.63 13.95,23.77 13.95,35.66 12.8,36.8 JP3.7 | JP2.7 12.8,67.21 12.8,56.24 13.95,55.09 13.95,53.26 12.8,52.12 JP1.7
  Bottom 0.254: JP3.7 12.8,37.03 12.8,37.72 13.95,38.86 13.95,50.75 12.8,51.89 JP1.7
N$1
  Bottom 0.406: 0,0 0,76.2 101.6,76.2 101.6,0 0,0
N$2  (via drill 0.61)
  Top 0.254: v92.81,52.12 92.81,50.29 IC3.3 | v96.01,54.63 96.01,55.78 96.47,56.24 IC3.9
  Bottom 0.254: v92.81,52.12 93.5,52.12 v96.01,54.63
N$3  (via drill 0.61)
  Top 0.254: v76.81,32.92 74.98,34.75 74.98,37.49 IC2.1 | v79.78,27.2 79.78,25.6 80.01,25.38 IC1.5
  Bottom 0.254: v76.81,32.92 76.81,30.18 v79.78,27.2
N$4
  Top 0.254: IC3.12 92.81,56.46 92.81,57.15 93.5,57.84 96.93,57.84 97.61,57.15 97.61,56.46 IC3.8
N$5
  Top 0.254: IC2.3 77.5,37.49 77.5,34.98 81.15,31.32 81.15,30.63 IC1.9
N$6
  Top 0.254: IC1.6 81.15,25.15 81.15,11.43 74.98,5.26 R6.1
  Bottom 0.254: C1.1 86.18,50.75 86.18,44.58 81.38,39.78 81.38,11.66 74.98,5.26 R6.1
N$7  (via drill 0.61)
  Top 0.254: v92.81,54.63 93.95,55.78 93.95,56.24 IC3.11
  Bottom 0.254: v92.81,54.63 89.15,54.63 86.64,57.15 U$1.5
N$8
  Top 0.254: IC3.2 91.44,49.61 92.13,48.92 95.78,48.92 96.47,49.61 96.47,50.06 IC3.6
N$10
  Top 0.254: IC1.2 76.12,25.38 74.98,25.38 IC1.1 74.75,25.15 74.75,19.2 73.84,18.29 73.84,4.57 74.52,3.89 79.78,3.89 82.53,6.63 82.98,6.63 86.64,10.29 86.64,14.17 87.55,15.09 R7.1
  Bottom 0.254: C6.1 91.44,18.97 87.78,15.32 R7.1
N$12  (via drill 0.61)
  Top 0.254: v88.92,36.8 82.75,30.63 IC1.8
  Bottom 0.254: 89.15,36.8 92.81,36.8 93.95,35.66 C4.2 | 89.15,36.8 86.87,39.09 85.72,39.09 85.27,38.63 85.27,6.17 82.53,3.43 74.3,3.43 73.38,4.34 73.38,10.06 74.75,11.43 74.75,12.57 R3.1 | 89.15,36.8 v88.92,36.8
N$14  (via drill 0.61)
  Top 0.254: IC1.13 76.35,30.63 77.27,30.63 IC1.12 77.5,30.4 77.5,29.72 78.18,29.03 86.64,29.03 v91.67,34.06 | R4.2 82.75,7.77 82.75,8.91 86.18,12.34 86.18,15.32 88.24,17.37 95.1,17.37 97.61,19.89 97.61,29.49 96.7,30.4 C5.1
  Bottom 0.254: v91.67,34.06 93.04,34.06 96.47,30.63 C5.1
NMIN  (via drill 0.61)
  Top 0.254: v76.58,40.92 78.64,38.86 78.64,37.72 IC2.4
  Bottom 0.254: v76.58,40.92 75.21,40.92 74.75,40.46 74.75,17.83 R1.1 72.92,15.77 72.92,4.12 74.07,2.97 82.75,2.97 84.81,5.03 87.55,5.03 JP6.1
PH2
  Bottom 0.254: JP5.1 5.26,6.4 5.26,7.32 6.17,8.23 6.17,20.57 5.26,21.49 JP4.1 5.26,21.72 6.17,22.63 6.17,24.69 5.26,25.6 5.26,36.8 JP3.1 5.26,37.03 6.17,37.95 6.17,40.01 5.26,40.92 5.26,51.89 JP1.1 5.26,52.12 6.17,53.03 6.17,55.09 5.26,56.01 5.26,67.21 JP2.1
PU1  (via drill 0.61)
  Top 0.254: 90.3,53.03 90.3,54.63 91.44,55.78 IC3.13 | 90.3,53.03 90.3,50.29 IC3.1 90.07,50.06 88.24,48.23 v85.27,48.23 | 93.27,53.03 93.95,52.35 93.95,50.29 IC3.4 | 90.3,53.03 93.27,53.03 | 93.27,53.03 95.1,54.86 95.1,56.24 IC3.10
  Bottom 0.254: v85.27,48.23 80.92,43.89 80.92,16.92 74.98,10.97 74.98,10.29 R5.1
RASN
  Top 0.254: JP5.21 30.63,6.4 30.63,7.32 31.77,8.46 31.77,20.34 30.63,21.49 JP4.21 30.63,21.72 30.63,22.63 31.77,23.77 31.77,35.66 30.63,36.8 JP3.21 | JP2.21 30.63,67.21 30.63,56.01 31.77,54.86 31.77,53.26 30.63,52.12 JP1.21
  Bottom 0.254: JP3.21 30.63,37.03 30.63,37.95 31.77,39.09 31.77,50.75 30.63,51.89 JP1.21
RDY
  Top 0.254: JP5.23 33.15,6.4 33.15,7.32 34.29,8.46 34.29,20.34 33.15,21.49 JP4.23 | JP2.23 33.15,67.21 33.15,56.24 34.29,55.09 34.29,53.26 33.15,52.12 JP1.23
  Bottom 0.254: JP1.23 33.15,51.89 34.29,50.75 34.29,39.09 33.15,37.95 33.15,37.03 JP3.23 33.15,36.8 34.29,35.66 34.29,23.77 33.15,22.63 33.15,21.72 JP4.23
RESN  (via drill 0.61)
  Top 0.254: v76.12,34.98 76.12,37.49 IC2.2 | JP5.5 10.29,6.4 10.29,7.32 11.43,8.46 11.43,20.34 10.29,21.49 JP4.5 10.29,21.72 10.29,22.63 11.43,23.77 11.43,35.66 10.29,36.8 JP3.5 | JP2.5 10.29,67.21 10.29,56.24 11.43,55.09 11.43,53.26 10.29,52.12 JP1.5 10.29,51.89 11.2,50.98 12.8,50.98 24,39.78 24,39.09 24.92,38.18 30.86,38.18 31.77,37.26 31.77,36.35 40.46,27.66 v75.67,27.66
  Bottom 0.254: v76.12,34.98 76.12,33.6 75.89,33.38 75.89,27.66 | 75.89,27.66 75.89,18.29 76.12,18.06 76.12,16.46 74.98,15.32 R2.1 | JP3.5 10.29,37.03 10.29,37.95 11.43,39.09 11.43,50.75 10.29,51.89 JP1.5 | v75.67,27.66 75.89,27.66
RESTORE
  Top 0.254: R8.1 87.78,12.57 95.1,5.26 JP7.1
  Bottom 0.254: C4.1 93.95,30.4 93.95,26.98 92.58,25.6 92.58,17.6 87.78,12.8 R8.1
RW
  Top 0.254: JP5.27 38.18,6.4 38.18,7.32 39.32,8.46 39.32,20.34 38.18,21.49 JP4.27 | JP2.27 38.18,67.21 38.18,56.24 39.32,55.09 39.32,53.26 38.18,52.12 JP1.27
  Bottom 0.254: JP1.27 38.18,51.89 39.32,50.75 39.32,38.86 38.18,37.72 38.18,37.03 JP3.27 38.18,36.8 39.32,35.66 39.32,23.77 38.18,22.63 38.18,21.72 JP4.27
VCC
  Top 0.254: 19.89,66.98 20.12,67.21 JP2.13 19.89,66.98 | 19.89,66.98 19.2,66.29 19.2,54.18 20.12,53.26 20.12,52.12 JP1.13 20.34,51.89 21.49,51.89 26.06,47.32 74.98,47.32 | JP5.2 5.26,8.91 5.26,20.12 6.17,21.03 6.17,23.09 5.26,24 JP4.2 5.26,24.23 5.26,35.43 6.4,36.58 6.4,38.18 | 6.17,67.89 5.26,68.81 5.26,69.72 JP2.2 | 6.17,67.89 6.17,55.55 5.26,54.63 JP1.2 5.26,54.41 6.17,53.49 6.17,51.44 5.26,50.52 5.26,39.55 JP3.2 5.26,39.32 6.4,38.18 | 6.4,38.18 18.06,38.18 19.2,37.03 20.12,37.03 JP3.13 | 19.89,66.98 18.29,68.58 6.86,68.58 6.17,67.89 | C8.1 96.47,20.34 94.18,20.34 C7.1 93.95,20.12 92.81,20.12 90.53,17.83 82.75,17.83 R1.2 82.53,17.6 82.53,15.32 R2.2 82.53,15.09 82.53,12.8 R3.2 82.53,12.57 82.53,10.29 R5.2 | R8.2 95.33,12.8 95.33,15.09 R7.2 | 74.07,32 74.07,31.32 74.75,30.63 IC1.14 74.98,30.4 74.98,29.72 77.95,26.75 | 74.07,32 74.07,38.63 74.75,39.32 74.75,43.66 IC2.14 74.98,43.89 74.98,47.32 | 77.95,26.75 78.64,26.06 78.64,25.38 IC1.4 | IC1.10 80.01,31.32 79.32,32 74.07,32 | 77.95,26.75 79.32,28.12 86.41,28.12 88.7,30.4 91.44,30.4 C3.1 | 77.27,54.86 86.87,54.86 88.24,56.24 90.07,56.24 IC3.14 90.3,56.46 90.3,57.15 96.47,63.32 96.47,71.09 J1.1 | 77.27,54.86 74.98,57.15 U$1.8 | 74.98,47.32 76.35,48.69 76.35,53.95 77.27,54.86
  Bottom 0.254: JP5.13 20.12,6.4 20.12,7.54 19.2,8.46 19.2,20.57 20.12,21.49 JP4.13 20.34,21.72 20.34,22.4 21.49,23.55 21.49,35.66 JP3.13 | R7.2 95.1,15.32 94.18,16.23 94.18,20.12 C7.1 94.18,20.34 94.18,24 95.1,24.92 95.1,30.86 94.41,31.55 92.35,31.55 91.44,30.63 | R5.2 82.75,10.06 83.67,9.14 83.67,7.32 82.75,6.4 82.75,5.26 R6.2 82.53,5.03 81.38,3.89 74.52,3.89 73.84,4.57 73.84,5.49 74.75,6.4 74.75,7.54 R4.1 | 91.44,30.63 86.41,35.66 86.41,37.95 C2.1 | 91.44,30.63 C3.1
VD0
  Top 0.254: JP5.31 42.98,6.4 42.98,7.54 42.06,8.46 42.06,20.57 42.98,21.49 JP4.31 | JP2.31 42.98,67.21 42.98,56.01 42.06,55.09 42.06,53.03 42.98,52.12 JP1.31
  Bottom 0.254: JP1.31 43.2,51.89 44.35,50.75 44.35,38.86 43.2,37.72 43.2,37.03 JP3.31 44.35,35.66 44.35,23.55 43.2,22.4 43.2,21.72 JP4.31
VD1
  Top 0.254: JP5.33 45.72,7.32 44.58,8.46 44.58,20.34 45.72,21.49 JP4.33 | JP2.33 45.72,56.24 44.58,55.09 44.58,53.26 45.72,52.12 JP1.33
  Bottom 0.254: JP1.33 45.72,51.89 46.86,50.75 46.86,38.86 45.72,37.72 JP3.33 45.72,36.8 46.86,35.66 46.86,23.55 45.72,22.4 JP4.33
VD2
  Top 0.254: JP5.35 48.46,6.4 48.46,7.54 49.38,8.46 49.38,20.57 48.46,21.49 JP4.35 | JP2.35 48.46,67.21 48.46,56.01 49.38,55.09 49.38,53.03 48.46,52.12 JP1.35
  Bottom 0.254: JP1.35 48.46,51.89 49.38,50.98 49.38,38.86 48.46,37.95 48.46,37.03 JP3.35 48.46,36.8 49.38,35.89 49.38,23.55 48.46,22.63 48.46,21.72 JP4.35
VD3
  Top 0.254: JP5.37 50.98,6.4 50.98,7.32 51.89,8.23 51.89,20.57 50.98,21.49 JP4.37 | JP2.37 50.98,67.21 50.98,56.01 51.89,55.09 51.89,53.03 50.98,52.12 JP1.37
  Bottom 0.254: JP1.37 51.89,50.98 51.89,38.86 50.98,37.95 50.98,37.03 JP3.37 50.98,36.8 51.89,35.89 51.89,23.55 50.98,22.63 50.98,21.72 JP4.37
VD4
  Top 0.254: JP5.39 53.49,6.4 53.49,7.32 54.63,8.46 54.63,20.34 53.49,21.49 JP4.39 | JP2.39 53.49,67.21 53.49,56.01 54.63,54.86 54.63,53.26 53.49,52.12 JP1.39
  Bottom 0.254: JP1.39 53.49,51.89 53.72,51.66 53.72,41.83 54.63,40.92 54.63,39.09 53.49,37.95 53.49,37.03 JP3.39 53.49,36.8 53.72,36.58 53.72,26.52 54.63,25.6 54.63,23.77 53.49,22.63 53.49,21.72 JP4.39
VD5
  Bottom 0.254: JP2.41 56.01,67.21 57.15,66.06 57.15,54.18 56.01,53.03 56.01,52.12 JP1.41 56.01,51.89 56.01,40.92 57.15,39.78 57.15,38.86 56.01,37.72 56.01,37.03 JP3.41 56.01,36.8 56.01,25.6 57.15,24.46 57.15,22.86 JP4.41 56.01,21.49 57.15,20.34 57.15,8.46 56.01,7.32 56.01,6.4 JP5.41
VD6
  Top 0.254: JP2.43 58.29,67.21 58.29,56.24 57.15,55.09 57.15,53.26 58.29,52.12 JP1.43
  Bottom 0.254: JP5.43 58.52,6.4 58.52,7.32 59.66,8.46 59.66,20.34 JP4.43 58.52,21.72 58.52,22.63 59.66,23.77 59.66,35.66 58.52,36.8 JP3.43 58.52,37.03 58.52,37.72 59.66,38.86 59.66,50.75 58.52,51.89 JP1.43
VD7
  Top 0.254: JP2.45 60.81,67.21 60.81,56.01 59.66,54.86 59.66,53.26 60.81,52.12 JP1.45
  Bottom 0.254: JP5.45 61.04,6.4 61.04,7.32 62.18,8.46 62.18,20.34 61.04,21.49 JP4.45 61.04,21.72 61.04,22.63 62.18,23.77 62.18,35.66 61.04,36.8 JP3.45 61.04,37.03 61.04,37.72 62.18,38.86 62.18,50.75 61.04,51.89 JP1.45